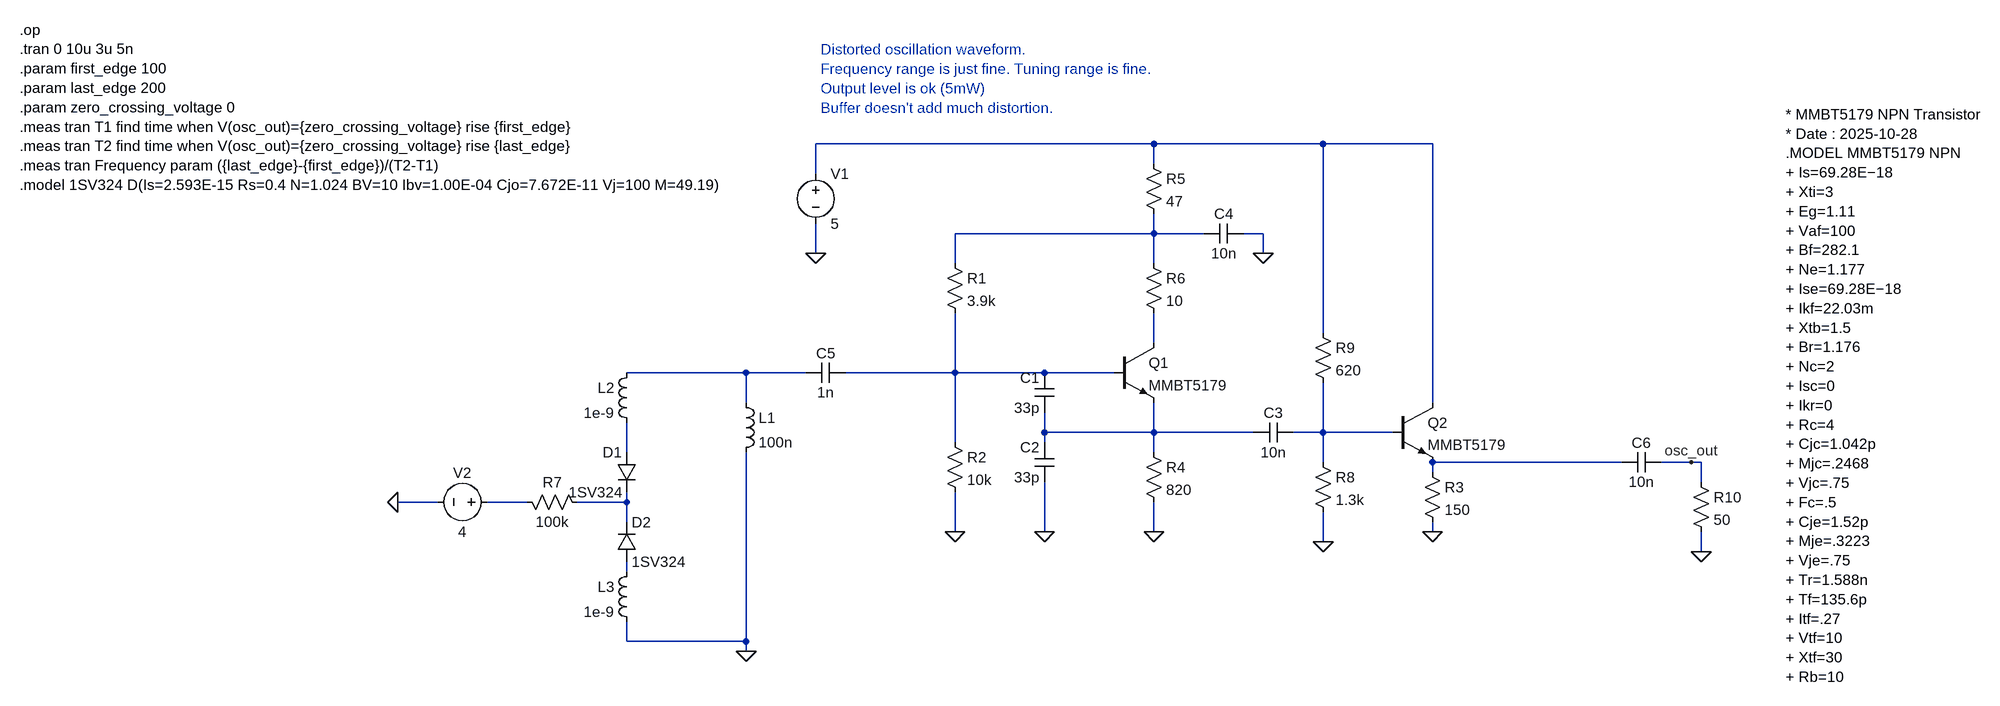
[diagram p0: schematic CC_Colpitts.asc]
CC_Colpitts.asc, the LTspice schematic file:
Version 4
SHEET 1 2200 2204
WIRE -624 544 -1168 544
WIRE -352 544 -624 544
WIRE -176 544 -352 544
WIRE -624 576 -624 544
WIRE -1168 592 -1168 544
WIRE -624 688 -624 656
WIRE -624 688 -944 688
WIRE -544 688 -624 688
WIRE -448 688 -480 688
WIRE -1168 720 -1168 672
WIRE -448 720 -448 688
WIRE -944 736 -944 688
WIRE -624 736 -624 688
WIRE -352 848 -352 544
WIRE -624 864 -624 816
WIRE -1280 912 -1472 912
WIRE -1184 912 -1280 912
WIRE -944 912 -944 816
WIRE -944 912 -1120 912
WIRE -800 912 -944 912
WIRE -688 912 -800 912
WIRE -1280 960 -1280 912
WIRE -176 960 -176 544
WIRE -800 1008 -800 976
WIRE -624 1008 -624 960
WIRE -624 1008 -800 1008
WIRE -464 1008 -624 1008
WIRE -352 1008 -352 928
WIRE -352 1008 -400 1008
WIRE -240 1008 -352 1008
WIRE -944 1024 -944 912
WIRE -800 1024 -800 1008
WIRE -1472 1040 -1472 992
WIRE -624 1040 -624 1008
WIRE -352 1056 -352 1008
WIRE 128 1056 -176 1056
WIRE 240 1056 192 1056
WIRE 256 1056 240 1056
WIRE -176 1072 -176 1056
WIRE 256 1088 256 1056
WIRE -1776 1120 -1840 1120
WIRE -1632 1120 -1696 1120
WIRE -1472 1120 -1472 1104
WIRE -1472 1120 -1552 1120
WIRE -1472 1152 -1472 1120
WIRE -944 1168 -944 1104
WIRE -800 1168 -800 1088
WIRE -624 1168 -624 1120
WIRE -176 1168 -176 1152
WIRE -352 1184 -352 1136
WIRE 256 1200 256 1168
WIRE -1472 1232 -1472 1216
WIRE -1472 1344 -1472 1312
WIRE -1280 1344 -1280 1040
WIRE -1280 1344 -1472 1344
WIRE -1280 1360 -1280 1344
FLAG -1168 720 0
FLAG -944 1168 0
FLAG -800 1168 0
FLAG -624 1168 0
FLAG -448 720 0
FLAG 240 1056 osc_out
FLAG -1280 1360 0
FLAG -1840 1120 0
FLAG -176 1168 0
FLAG 256 1200 0
FLAG -352 1184 0
DATAFLAG -1040 912 ""
DATAFLAG -704 1008 ""
DATAFLAG -832 688 ""
DATAFLAG 32 1056 ""
SYMBOL voltage -1168 576 R0
SYMATTR InstName V1
SYMATTR Value 5
SYMBOL res -960 720 R0
SYMATTR InstName R1
SYMATTR Value 3.9k
SYMBOL res -960 1008 R0
SYMATTR InstName R2
SYMATTR Value 10k
SYMBOL res -640 1024 R0
SYMATTR InstName R4
SYMATTR Value 820
SYMBOL res -640 560 R0
SYMATTR InstName R5
SYMATTR Value 47
SYMBOL cap -480 672 R90
WINDOW 0 0 32 VBottom 2
WINDOW 3 32 32 VTop 2
SYMATTR InstName C4
SYMATTR Value 10n
SYMBOL cap -784 976 R180
WINDOW 0 24 56 Left 2
WINDOW 3 24 8 Left 2
SYMATTR InstName C1
SYMATTR Value 33p
SYMBOL cap -784 1088 R180
WINDOW 0 24 56 Left 2
WINDOW 3 24 8 Left 2
SYMATTR InstName C2
SYMATTR Value 33p
SYMBOL ind -1296 944 R0
SYMATTR InstName L1
SYMATTR Value 100n
SYMATTR SpiceLine Rser=1.17
SYMBOL npn -688 864 R0
SYMATTR InstName Q1
SYMATTR Value MMBT5179
SYMBOL res -640 720 R0
SYMATTR InstName R6
SYMATTR Value 10
SYMBOL cap -1120 896 R90
WINDOW 0 0 32 VBottom 2
WINDOW 3 32 32 VTop 2
SYMATTR InstName C5
SYMATTR Value 1n
SYMBOL cap -400 992 R90
WINDOW 0 0 32 VBottom 2
WINDOW 3 32 32 VTop 2
SYMATTR InstName C3
SYMATTR Value 10n
SYMBOL res -1536 1136 M270
WINDOW 0 32 56 VTop 2
WINDOW 3 0 56 VBottom 2
SYMATTR InstName R7
SYMATTR Value 100k
SYMBOL voltage -1680 1120 M270
WINDOW 0 32 56 VTop 2
WINDOW 3 -32 56 VBottom 2
SYMATTR InstName V2
SYMATTR Value 4
SYMBOL diode -1456 1040 M0
SYMATTR InstName D1
SYMATTR Value 1SV324
SYMBOL diode -1488 1216 M180
WINDOW 0 24 64 Left 2
WINDOW 3 24 0 Left 2
SYMATTR InstName D2
SYMATTR Value 1SV324
SYMBOL ind -1456 896 M0
SYMATTR InstName L2
SYMATTR Value 1e-9
SYMBOL ind -1456 1216 M0
SYMATTR InstName L3
SYMATTR Value 1e-9
SYMBOL res 240 1072 R0
SYMATTR InstName R10
SYMATTR Value 50
SYMBOL cap 192 1040 R90
WINDOW 0 0 32 VBottom 2
WINDOW 3 32 32 VTop 2
SYMATTR InstName C6
SYMATTR Value 10n
SYMBOL res -192 1056 R0
SYMATTR InstName R3
SYMATTR Value 150
SYMBOL res -368 1040 R0
SYMATTR InstName R8
SYMATTR Value 1.3k
SYMBOL res -368 832 R0
SYMATTR InstName R9
SYMATTR Value 620
SYMBOL npn -240 960 R0
SYMATTR InstName Q2
SYMATTR Value MMBT5179
TEXT -2448 360 Left 2 !.op\n.tran 0 10u 3u 5n\n.param first_edge 100\n.param last_edge 200\n.param zero_crossing_voltage 0\n.meas tran T1 find time when V(osc_out)={zero_crossing_voltage} rise {first_edge}\n.meas tran T2 find time when V(osc_out)={zero_crossing_voltage} rise {last_edge}\n.meas tran Frequency param ({last_edge}-{first_edge})/(T2-T1)\n.model 1SV324 D(Is=2.593E-15 Rs=0.4 N=1.024 BV=10 Ibv=1.00E-04 Cjo=7.672E-11 Vj=100 M=49.19)
TEXT 392 496 Left 2 !* MMBT5179 NPN Transistor\n* Date : 2025-10-28\n.MODEL MMBT5179 NPN\n+ Is=69.28E−18 \n+ Xti=3 \n+ Eg=1.11 \n+ Vaf=100 \n+ Bf=282.1 \n+ Ne=1.177 \n+ Ise=69.28E−18 \n+ Ikf=22.03m \n+ Xtb=1.5 \n+ Br=1.176 \n+ Nc=2 \n+ Isc=0 \n+ Ikr=0 \n+ Rc=4 \n+ Cjc=1.042p \n+ Mjc=.2468 \n+ Vjc=.75 \n+ Fc=.5 \n+ Cje=1.52p \n+ Mje=.3223 \n+ Vje=.75 \n+ Tr=1.588n \n+ Tf=135.6p \n+ Itf=.27 \n+ Vtf=10 \n+ Xtf=30 \n+ Rb=10
TEXT -1160 392 Left 2 ;Distorted oscillation waveform.\nFrequency range is just fine. Tuning range is fine.\nOutput level is ok (5mW)\nBuffer doesn't add much distortion.

The netlist it stands for:
* CC_Colpitts.asc
V1 N001 0 5
R1 N002 N005 3.9k
R2 N005 0 10k
R4 N006 0 820
R5 N001 N002 47
C4 0 N002 10n
C1 N006 N005 33p
C2 0 N006 33p
L1 N004 0 100n Rser=1.17
Q1 N003 N005 N006 0 MMBT5179
R6 N002 N003 10
C5 N005 N004 1n
C3 N007 N006 10n
R7 N011 N010 100k
V2 N010 0 4
D1 N008 N011 1SV324
D2 N012 N011 1SV324
L2 N004 N008 1e-9
L3 N012 0 1e-9
R10 osc_out 0 50
C6 osc_out N009 10n
R3 N009 0 150
R8 N007 0 1.3k
R9 N001 N007 620
Q2 N001 N007 N009 0 MMBT5179
.model D D
.lib standard.dio
.model NPN NPN
.model PNP PNP
.lib standard.bjt
.op
.tran 0 10u 3u 5n
.param first_edge 100
.param last_edge 200
.param zero_crossing_voltage 0
.meas tran T1 find time when V(osc_out)={zero_crossing_voltage} rise {first_edge}
.meas tran T2 find time when V(osc_out)={zero_crossing_voltage} rise {last_edge}
.meas tran Frequency param ({last_edge}-{first_edge})/(T2-T1)
.model 1SV324 D(Is=2.593E-15 Rs=0.4 N=1.024 BV=10 Ibv=1.00E-04 Cjo=7.672E-11 Vj=100 M=49.19)
* MMBT5179 NPN Transistor
* Date : 2025-10-28
.MODEL MMBT5179 NPN
+ Is=69.28E−18
+ Xti=3
+ Eg=1.11
+ Vaf=100
+ Bf=282.1
+ Ne=1.177
+ Ise=69.28E−18
+ Ikf=22.03m
+ Xtb=1.5
+ Br=1.176
+ Nc=2
+ Isc=0
+ Ikr=0
+ Rc=4
+ Cjc=1.042p
+ Mjc=.2468
+ Vjc=.75
+ Fc=.5
+ Cje=1.52p
+ Mje=.3223
+ Vje=.75
+ Tr=1.588n
+ Tf=135.6p
+ Itf=.27
+ Vtf=10
+ Xtf=30
+ Rb=10
* Distorted oscillation waveform.
* Frequency range is just fine. Tuning range is fine.
* Output level is ok (5mW)
* Buffer doesn't add much distortion.
.backanno
.end